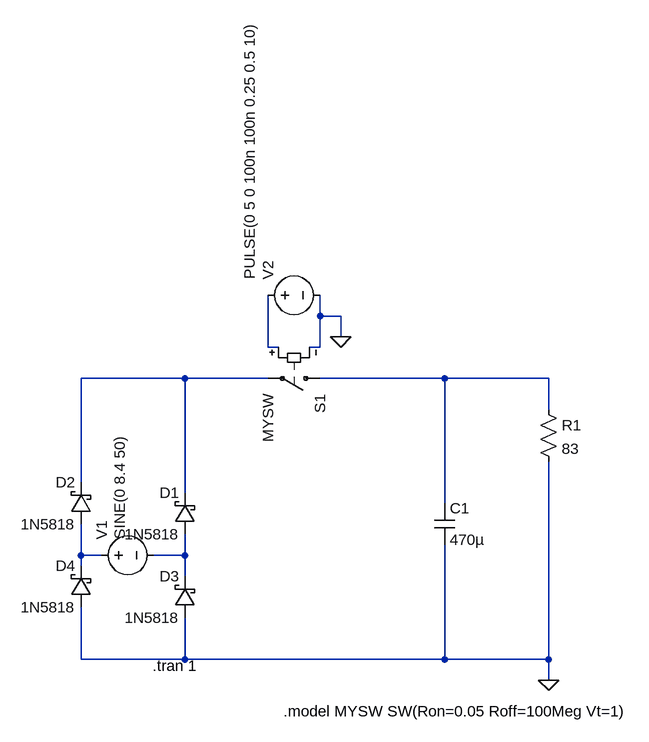
[diagram p0: schematic softstart_cap_sizing.asc]
softstart_cap_sizing.asc, the LTspice schematic file:
Version 4
SHEET 1 880 680
WIRE 48 0 48 -32
WIRE 80 0 48 0
WIRE 80 32 80 0
WIRE -32 48 -32 -32
WIRE -16 48 -32 48
WIRE 48 48 48 0
WIRE 48 48 32 48
WIRE -160 96 -320 96
WIRE -32 96 -160 96
WIRE 240 96 48 96
WIRE 400 96 240 96
WIRE 400 144 400 96
WIRE -320 256 -320 96
WIRE -160 272 -160 96
WIRE 240 288 240 96
WIRE -320 368 -320 320
WIRE -288 368 -320 368
WIRE -160 368 -160 336
WIRE -160 368 -208 368
WIRE -320 384 -320 368
WIRE -160 400 -160 368
WIRE -320 528 -320 448
WIRE -160 528 -160 464
WIRE -160 528 -320 528
WIRE 240 528 240 352
WIRE 240 528 -160 528
WIRE 400 528 400 224
WIRE 400 528 240 528
WIRE 400 560 400 528
FLAG 400 560 0
FLAG 80 32 0
SYMBOL voltage -304 368 R270
WINDOW 3 24 44 Left 2
WINDOW 123 0 0 Left 0
WINDOW 39 0 0 Left 0
SYMATTR InstName V1
SYMATTR Value SINE(0 8.4 50)
SYMBOL cap 224 288 R0
SYMATTR InstName C1
SYMATTR Value 470µ
SYMATTR SpiceLine Rser=1
SYMBOL res 384 128 R0
SYMATTR InstName R1
SYMATTR Value 83
SYMBOL sw 64 96 R90
SYMATTR InstName S1
SYMATTR Value MYSW
SYMBOL voltage -48 -32 R270
WINDOW 3 24 -12 Left 2
WINDOW 123 0 0 Left 0
WINDOW 39 0 0 Left 0
SYMATTR InstName V2
SYMATTR Value PULSE(0 5 0 100n 100n 0.25 0.5 10)
SYMBOL schottky -144 336 R180
WINDOW 0 24 64 Left 2
WINDOW 3 24 0 Left 2
SYMATTR InstName D1
SYMATTR Value 1N5818
SYMATTR Description Diode
SYMATTR Type diode
SYMBOL schottky -304 320 R180
WINDOW 0 24 64 Left 2
WINDOW 3 24 0 Left 2
SYMATTR InstName D2
SYMATTR Value 1N5818
SYMATTR Description Diode
SYMATTR Type diode
SYMBOL schottky -144 464 R180
WINDOW 0 24 64 Left 2
WINDOW 3 24 0 Left 2
SYMATTR InstName D3
SYMATTR Value 1N5818
SYMATTR Description Diode
SYMATTR Type diode
SYMBOL schottky -304 448 R180
WINDOW 0 24 64 Left 2
WINDOW 3 24 0 Left 2
SYMATTR InstName D4
SYMATTR Value 1N5818
SYMATTR Description Diode
SYMATTR Type diode
TEXT -210 538 Left 2 !.tran 1
TEXT -8 608 Left 2 !.model MYSW SW(Ron=0.05 Roff=100Meg Vt=1)

The netlist it stands for:
* softstart_cap_sizing.asc
V1 N004 N005 SINE(0 8.4 50)
C1 N003 0 470µ Rser=1
R1 N003 0 83
S1 N003 N002 N001 0 MYSW
V2 N001 0 PULSE(0 5 0 100n 100n 0.25 0.5 10)
D1 N005 N002 1N5818
D2 N004 N002 1N5818
D3 0 N005 1N5818
D4 0 N004 1N5818
.model D D
.lib standard.dio
.tran 1
.model MYSW SW(Ron=0.05 Roff=100Meg Vt=1)
.backanno
.end